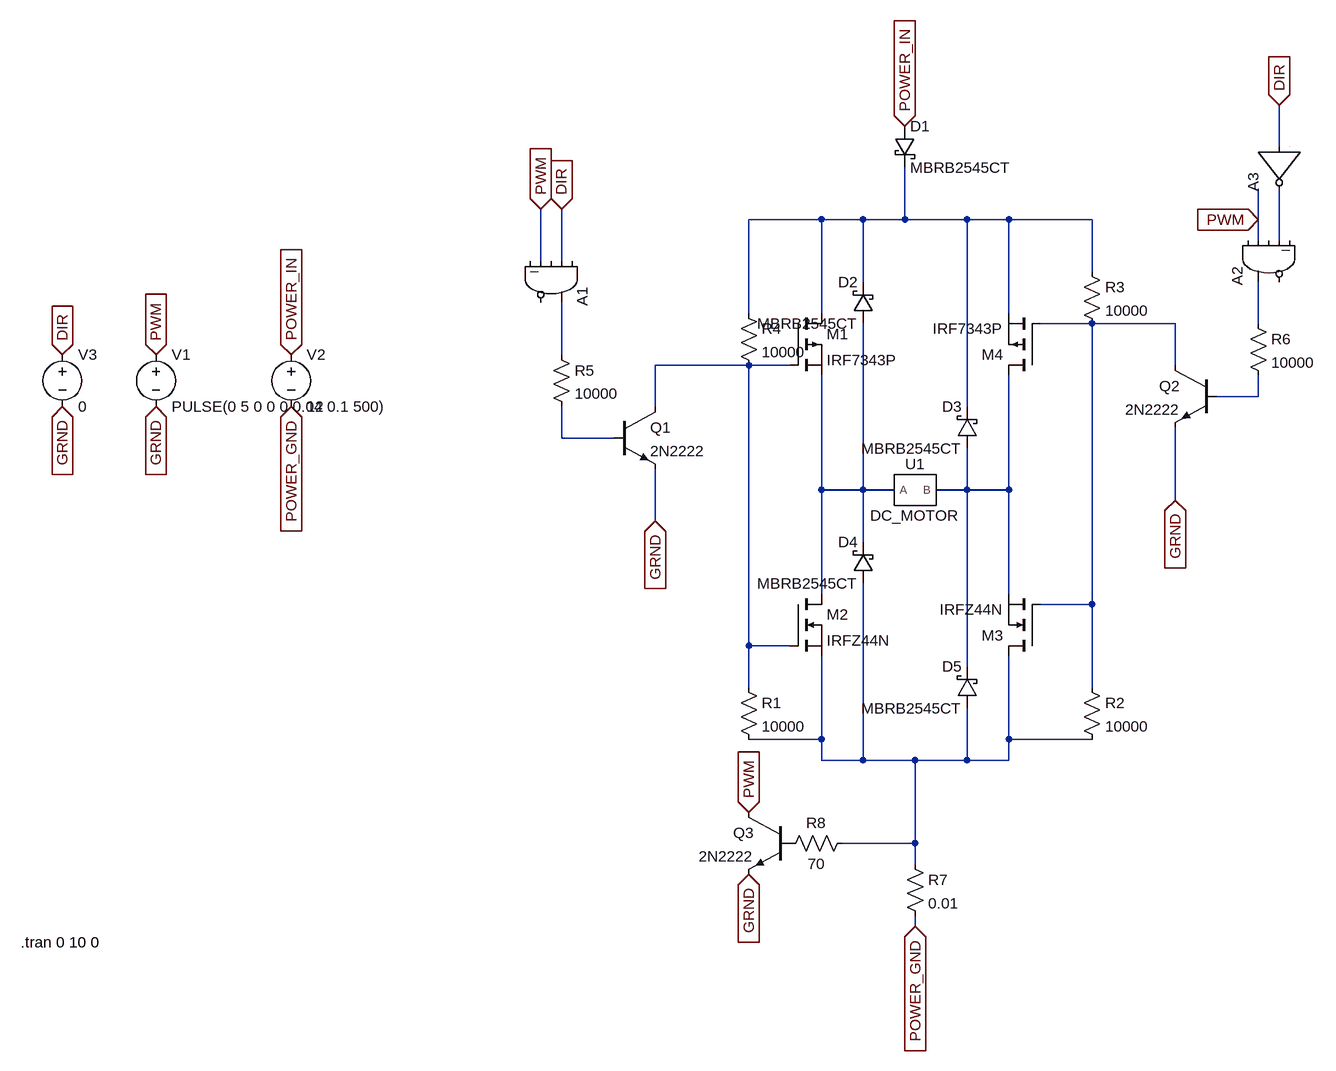
[diagram p0: schematic Draft4 - Copy.asc]
Draft4 - Copy.asc, the LTspice schematic file:
Version 4.1
SHEET 1 984 1044
WIRE 752 -368 752 -432
WIRE 48 -256 -64 -256
WIRE 112 -256 48 -256
WIRE 176 -256 176 -336
WIRE 176 -256 112 -256
WIRE 272 -256 176 -256
WIRE 336 -256 272 -256
WIRE 464 -256 336 -256
WIRE 720 -256 720 -304
WIRE 720 -224 720 -256
WIRE 752 -224 752 -304
WIRE -384 -192 -384 -272
WIRE -352 -192 -352 -272
WIRE 464 -176 464 -256
WIRE 112 -160 112 -256
WIRE -64 -112 -64 -256
WIRE 48 -112 48 -256
WIRE 336 -112 336 -256
WIRE 464 -96 384 -96
WIRE 592 -96 464 -96
WIRE 720 -96 720 -160
WIRE -352 -48 -352 -128
WIRE -64 -32 -208 -32
WIRE 0 -32 -64 -32
WIRE 592 -32 592 -96
WIRE 720 16 720 -16
WIRE 720 16 656 16
WIRE -208 32 -208 -32
WIRE 272 32 272 -256
WIRE -352 80 -352 32
WIRE -272 80 -352 80
WIRE 48 160 48 -16
WIRE 112 160 112 -96
WIRE 112 160 48 160
WIRE 160 160 112 160
WIRE 272 160 272 96
WIRE 272 160 224 160
WIRE 336 160 336 -16
WIRE 336 160 272 160
WIRE 592 176 592 64
WIRE -208 208 -208 128
WIRE 112 240 112 160
WIRE 48 320 48 160
WIRE 336 320 336 160
WIRE 464 336 464 -96
WIRE 464 336 384 336
WIRE -64 400 -64 -32
WIRE 0 400 -64 400
WIRE 272 432 272 160
WIRE -64 464 -64 400
WIRE 464 464 464 336
WIRE 48 544 48 416
WIRE 48 544 -64 544
WIRE 336 544 336 416
WIRE 464 544 336 544
WIRE 48 576 48 544
WIRE 112 576 112 304
WIRE 112 576 48 576
WIRE 192 576 112 576
WIRE 272 576 272 496
WIRE 272 576 192 576
WIRE 336 576 336 544
WIRE 336 576 272 576
WIRE 192 704 192 576
WIRE 192 704 80 704
WIRE 192 736 192 704
WIRE 192 832 192 816
FLAG 176 -400 POWER_IN
IOPIN 176 -400 In
FLAG 192 832 POWER_GND
IOPIN 192 832 In
FLAG -208 208 GRND
IOPIN -208 208 In
FLAG 592 176 GRND
IOPIN 592 176 In
FLAG -384 -272 PWM
IOPIN -384 -272 In
FLAG 720 -256 PWM
IOPIN 720 -256 In
FLAG -352 -272 DIR
IOPIN -352 -272 In
FLAG 752 -432 DIR
IOPIN 752 -432 In
FLAG -768 -48 POWER_IN
IOPIN -768 -48 In
FLAG -768 32 POWER_GND
IOPIN -768 32 In
FLAG -976 -48 PWM
IOPIN -976 -48 In
FLAG -976 32 GRND
IOPIN -976 32 In
FLAG -1120 -48 DIR
IOPIN -1120 -48 In
FLAG -1120 32 GRND
IOPIN -1120 32 In
FLAG -64 656 PWM
IOPIN -64 656 In
FLAG -64 752 GRND
IOPIN -64 752 In
SYMBOL DC_MOTOR0 192 160 R0
SYMATTR InstName U1
SYMBOL nmos 0 320 R0
SYMATTR InstName M2
SYMATTR Value IRFZ44N
SYMBOL nmos 384 416 R180
SYMATTR InstName M3
SYMATTR Value IRFZ44N
SYMBOL pmos 0 -112 R0
SYMATTR InstName M1
SYMATTR Value IRF7343P
SYMBOL pmos 384 -16 R180
SYMATTR InstName M4
SYMATTR Value IRF7343P
SYMBOL res -80 448 R0
SYMATTR InstName R1
SYMATTR Value 10000
SYMBOL res 448 448 R0
SYMATTR InstName R2
SYMATTR Value 10000
SYMBOL res 448 -192 R0
SYMATTR InstName R3
SYMATTR Value 10000
SYMBOL res -80 -128 R0
SYMATTR InstName R4
SYMATTR Value 10000
SYMBOL npn -272 32 R0
SYMATTR InstName Q1
SYMATTR Value 2N2222
SYMBOL npn 656 -32 M0
SYMATTR InstName Q2
SYMATTR Value 2N2222
SYMBOL res -368 -64 R0
SYMATTR InstName R5
SYMATTR Value 10000
SYMBOL res 704 -112 R0
SYMATTR InstName R6
SYMATTR Value 10000
SYMBOL Digital\\and -304 -160 R90
SYMATTR InstName A1
SYMBOL Digital\\and 672 -192 M90
SYMATTR InstName A2
SYMBOL Digital\\inv 688 -368 M90
SYMATTR InstName A3
SYMBOL voltage -976 -64 R0
WINDOW 123 0 0 Left 0
WINDOW 39 0 0 Left 0
SYMATTR InstName V1
SYMATTR Value PULSE(0 5 0 0 0 0.04 0.1 500)
SYMBOL voltage -768 -64 R0
WINDOW 123 0 0 Left 0
WINDOW 39 0 0 Left 0
SYMATTR InstName V2
SYMATTR Value 12
SYMBOL voltage -1120 -64 R0
WINDOW 123 0 0 Left 0
WINDOW 39 0 0 Left 0
SYMATTR InstName V3
SYMATTR Value 0
SYMBOL schottky 160 -400 R0
SYMATTR InstName D1
SYMATTR Value MBRB2545CT
SYMBOL schottky 128 -96 R180
WINDOW 0 24 64 Left 2
WINDOW 3 24 0 Left 2
SYMATTR InstName D2
SYMATTR Value MBRB2545CT
SYMBOL schottky 288 96 R180
WINDOW 0 24 64 Left 2
WINDOW 3 24 0 Left 2
SYMATTR InstName D3
SYMATTR Value MBRB2545CT
SYMBOL schottky 128 304 R180
WINDOW 0 24 64 Left 2
WINDOW 3 24 0 Left 2
SYMATTR InstName D4
SYMATTR Value MBRB2545CT
SYMBOL schottky 288 496 R180
WINDOW 0 24 64 Left 2
WINDOW 3 24 0 Left 2
SYMATTR InstName D5
SYMATTR Value MBRB2545CT
SYMBOL res 176 720 R0
SYMATTR InstName R7
SYMATTR Value 0.01
SYMBOL npn 0 656 M0
SYMATTR InstName Q3
SYMATTR Value 2N2222
SYMBOL res 96 688 R90
WINDOW 0 0 56 VBottom 2
WINDOW 3 32 56 VTop 2
SYMATTR InstName R8
SYMATTR Value 70
TEXT -1184 856 Left 2 !.tran 0 10 0

The netlist it stands for:
* Draft4 - Copy.asc
X§U1 N009 N010 DC_MOTOR  ; pins A B
M2 N009 N006 N011 N011 IRFZ44N
M3 N011 N003 N010 N010 IRFZ44N
M1 N001 N006 N009 N009 IRF7343P
M4 N010 N003 N001 N001 IRF7343P
R1 N006 N011 10000
R2 N003 N011 10000
R3 N001 N003 10000
R4 N001 N006 10000
Q1 N006 N008 GRND 0 2N2222
Q2 N003 N007 GRND 0 2N2222
R5 N005 N008 10000
R6 N004 N007 10000
A1 0 DIR 0 PWM 0 0 N005 0 AND
A2 0 PWM 0 N002 0 0 N004 0 AND
A3 DIR 0 0 0 0 N002 0 0 BUF
V1 PWM GRND PULSE(0 5 0 0 0 0.04 0.1 500)
V2 POWER_IN POWER_GND 12
V3 DIR GRND 0
D1 POWER_IN N001 MBRB2545CT
D2 N009 N001 MBRB2545CT
D3 N010 N001 MBRB2545CT
D4 N011 N009 MBRB2545CT
D5 N011 N010 MBRB2545CT
R7 N011 POWER_GND 0.01
Q3 PWM P001 GRND 0 2N2222
R8 N011 P001 70
.model D D
.lib standard.dio
.model NPN NPN
.model PNP PNP
.lib standard.bjt
.model NMOS NMOS
.model PMOS PMOS
.lib standard.mos
.tran 0 10 0
.lib C:\Users\arnab\Documents\LTspice\DC_motor.lib
.backanno
.end